# Altium schematic sheet TH8_Supply.schdoc: Thermostat 8CH (part 1 of 2)
size 420 x 297 mm; EDA_Number: ARTIQ; Projet: Thermostat; Author: G.Kasprowicz; CompanyName: WUT ISE; DrawnBy: G.Kasprowicz; Organization: WUT ISE; Address1: PW ISE; Address2: Nowowiejska 15/19 00-665 Warsaw; Address3: gkasprow@gmail.com; DocumentNumber: 5; Revision: 2.0; SheetNumber: 5; SheetTotal: 9; ModifiedBy: -; CheckedDate: -; Title2: Power supply; DivGrp: WUT ISE; Designer: G.Kasprowicz; ModifiedDate: -; ProjectName: Sensor Box
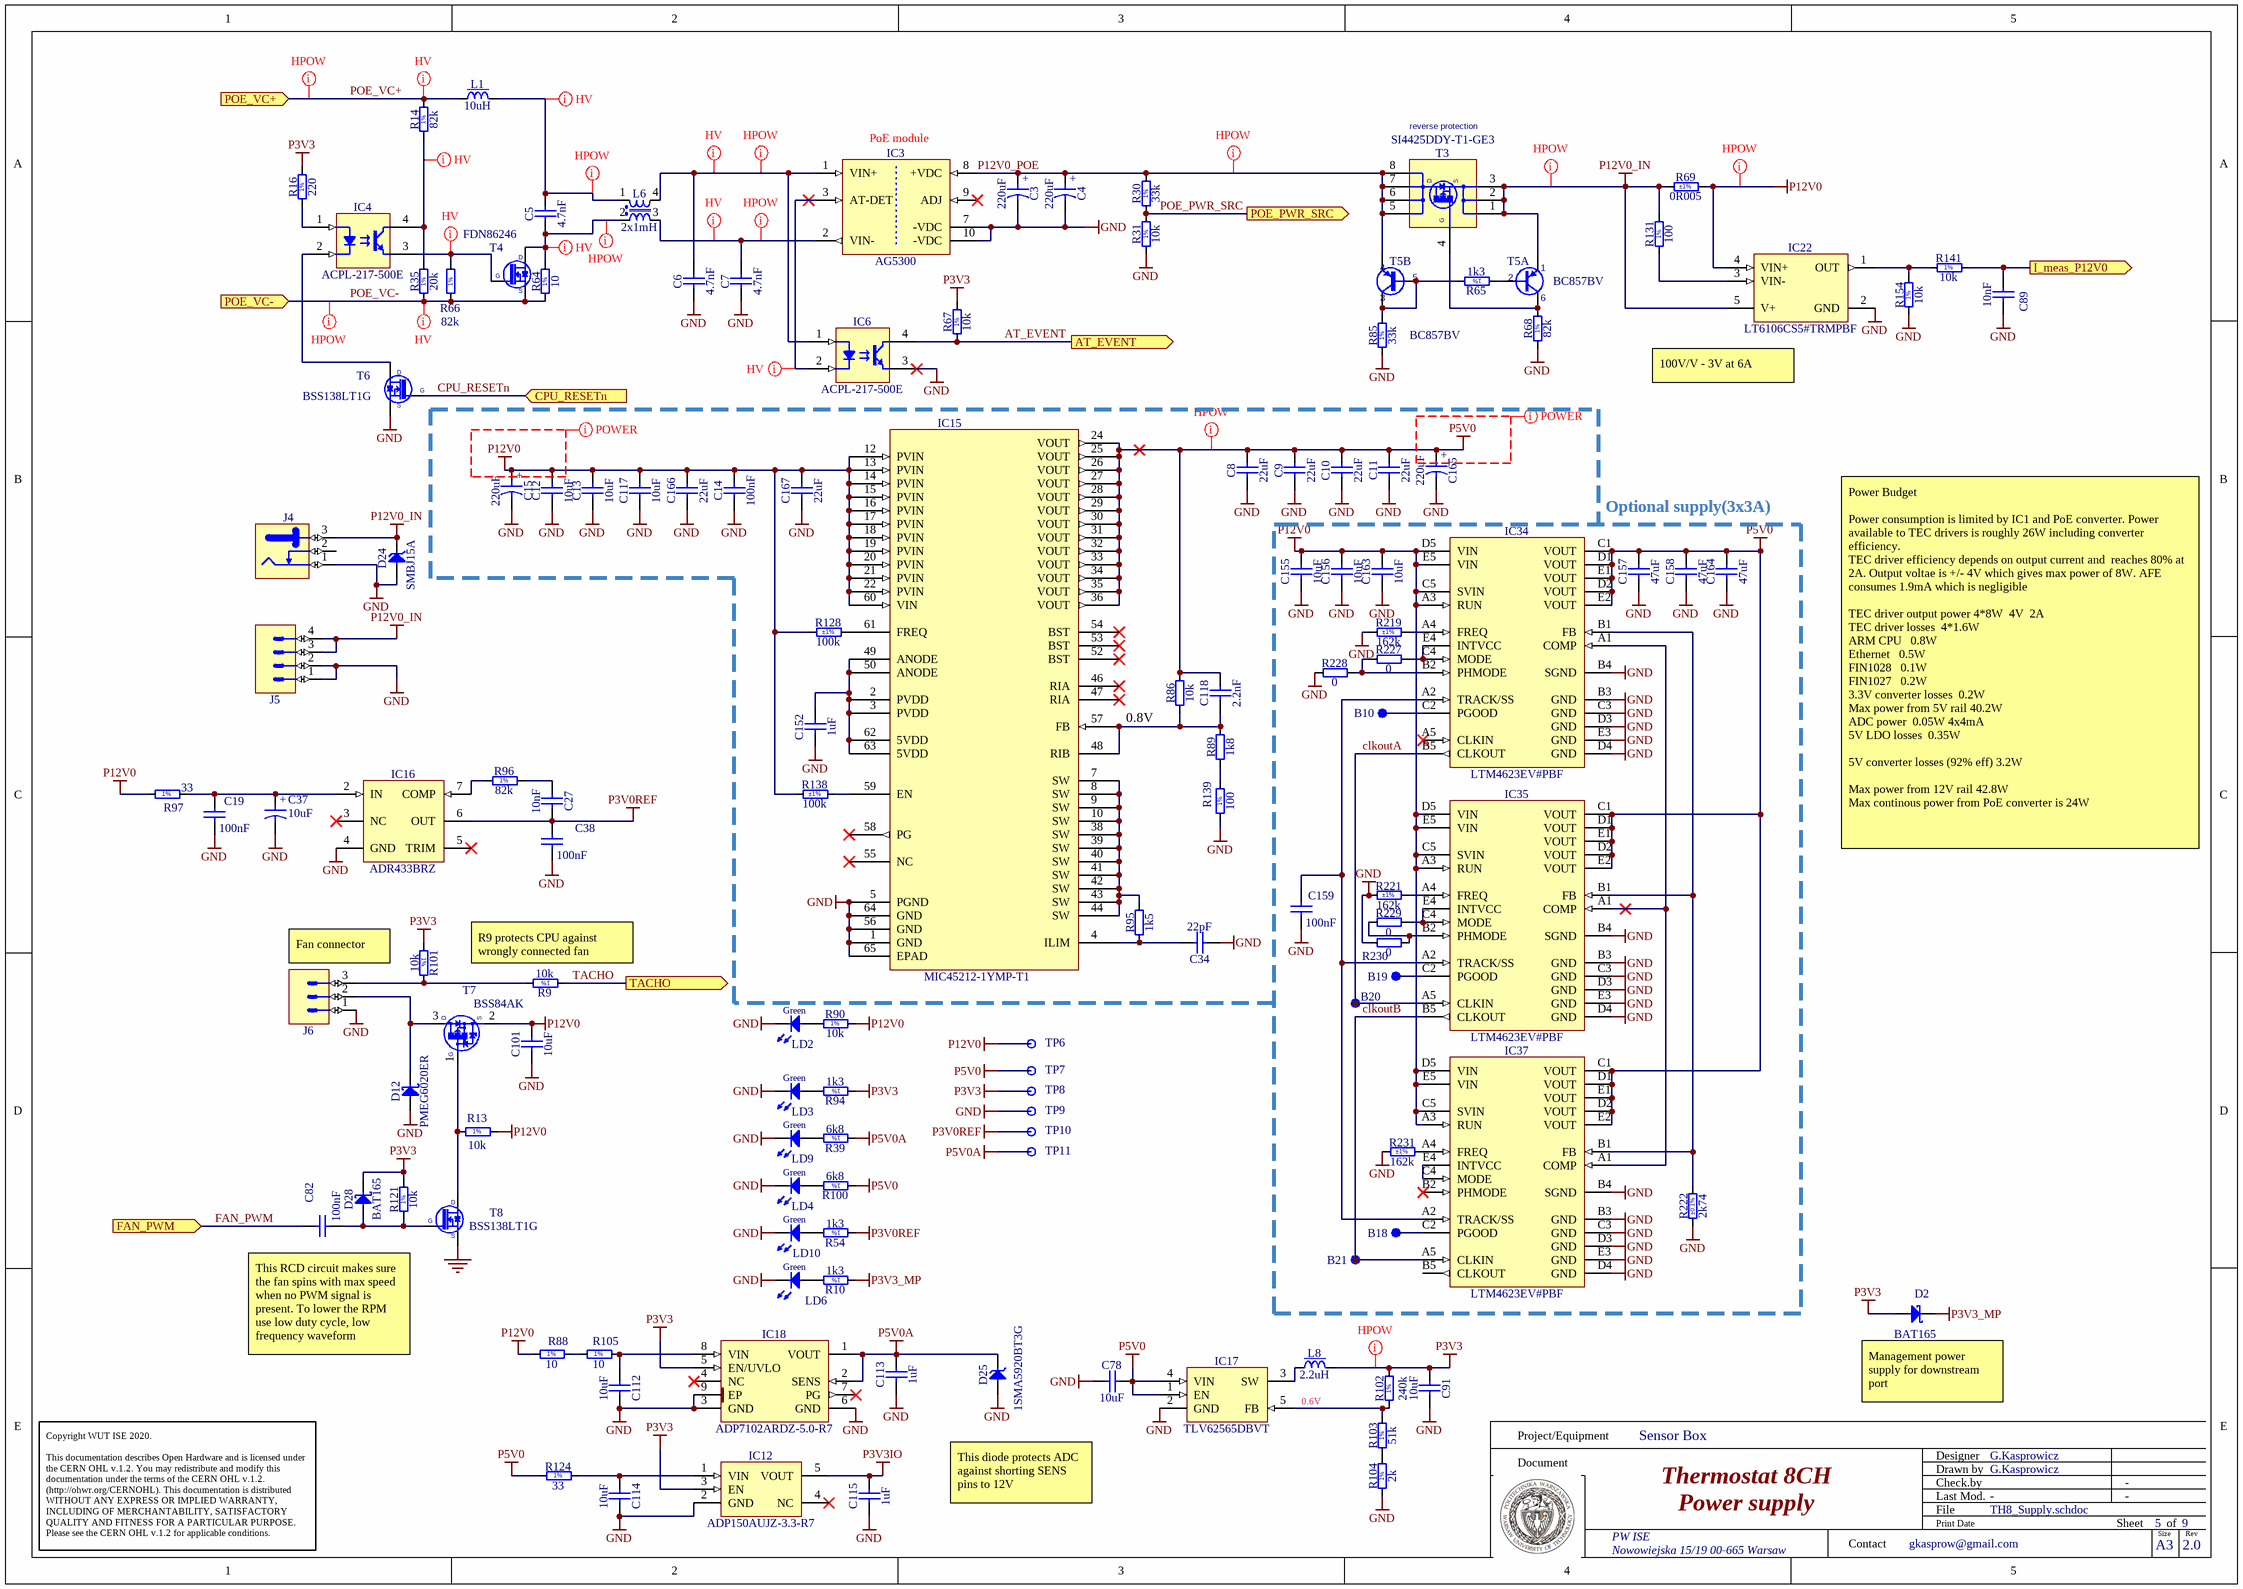
[diagram p0: TH8_Supply.schdoc]

## Parts
B10  SMD Pad  [C75]  (value not drawn)  (no BOM)
B18  SMD Pad  [C75]  (value not drawn)  (no BOM)
B19  SMD Pad  [C75]  (value not drawn)  (no BOM)
B20  SMD Pad  [C75]  (value not drawn)  (no BOM)
B21  SMD Pad  [C75]  (value not drawn)  (no BOM)
C3  220uF  [CAPMP7343X430N]
C4  220uF  [CAPMP7343X430N]
C5  4.7nF  [CAPC3216X140N]
C6  4.7nF  [CAPC3216X140N]
C7  4.7nF  [CAPC3216X140N]
C8  22uF  [CAPC2012X135N]
C9  22uF  [CAPC2012X135N]
C10  22uF  [CAPC2012X135N]
C11  22uF  [CAPC2012X135N]
C12  10uF  [CAPC2012X135N]
C13  10uF  [CAPC2012X135N]
C14  100nF  [CAPC1005X55N]
C15  220uF  [CAPMP7343X430N]
C19  100nF  [CAPC1005X55N]
C27  10nF  [CAPC1005X55N]
C34  22pF  [CAPC1005X55N]
C37  10uF  [CAPMP3216X180N]
C38  100nF  [CAPC1005X55N]
C78  10uF  [CAPC2012X135N]
C82  100nF  [CAPC1005X55N]
C89  10nF  [CAPC1005X55N]
C91  10uF  [CAPC2012X135N]
C101  10uF  [CAPC2012X135N]
C112  10uF  [CAPC2012X135N]
C113  1uF  [CAPC1608X87N]
C114  10uF  [CAPC2012X135N]
C115  1uF  [CAPC1608X87N]
C117  10uF  [CAPC2012X135N]
C118  2.2nF  [CAPC1608X87N]
C152  1uF  [CAPC1608X87N]
C155  10uF  [CAPC2012X135N]
C156  10uF  [CAPC2012X135N]
C157  47uF  [CAPC2012X145N]
C158  47uF  [CAPC2012X145N]
C159  100nF  [CAPC1005X55N]
C163  10uF  [CAPC2012X135N]
C164  47uF  [CAPC2012X145N]
C165  220uF  [CAPMP7343X430N]
C166  22uF  [CAPC2012X135N]
C167  22uF  [CAPC2012X135N]
D2  BAT165  [SOD2512X110N]
D12  PMEG6020ER  [SODFL3517X110N]
D24  SMBJ15A  [DIOM5336X265N]
D25  1SMA5920BT3G  [DIOM5226X220N]
D28  BAT165  [SOD2512X110N]
IC3  AG5300  [SILVERTEL_AG5300]
IC4  ACPL-217-500E  [SOIC127P700X242-4N]
IC6  ACPL-217-500E  [SOIC127P700X242-4N]
IC12  ADP150AUJZ-3.3-R7  [SOT95P280X90-5N]
IC15  MIC45212-1YMP-T1  [MICROCHIP_QFN64_12X12]
IC16  ADR433BRZ  [SOIC127P600X175-8N]
IC17  TLV62565DBVT  [SOT95P280X145-5N]
IC18  ADP7102ARDZ-5.0-R7  [SOIC127P600X175-9N-R241X309]
IC22  LT6106CS5#TRMPBF  [SOT95P280X145-5N]
IC34  LTM4623EV#PBF  [LGA25C127P5X5_625X625X192]
IC35  LTM4623EV#PBF  [LGA25C127P5X5_625X625X192]
IC37  LTM4623EV#PBF  [LGA25C127P5X5_625X625X192]
J4  Jack  [SWITCHCRAFT_L712RA]  (value not drawn)
J5  Mini-Fit Jr.™  [MOLEX_39-30-0040]  (value not drawn)
J6  KK®  [MOLEX_22-27-2031]  (value not drawn)
L1  10uH  [IND_MURATA-PS_8400]
L6  2x1mH  [IND_WURTH_WE-SL2]
L8  2.2uH  [IND_MURATA_LQH44PN_P0]
LD2  Green  [LED_KINGBRIGHT_KPH-1608CGCK]
LD3  Green  [LED_KINGBRIGHT_KPH-1608CGCK]
LD4  Green  [LED_KINGBRIGHT_KPH-1608CGCK]
LD6  Green  [LED_KINGBRIGHT_KPH-1608CGCK]
LD9  Green  [LED_KINGBRIGHT_KPH-1608CGCK]
LD10  Green  [LED_KINGBRIGHT_KPH-1608CGCK]
R9  10k  [RESC1005X40N]
R10  1k3  [RESC1608X55N]
R13  10k  [RESC1005X40N]
R14  82k  [RESC1608X55N]
R16  220  [RESC1608X55N]
R30  33k  [RESC1005X40N]
R31  10k  [RESC1005X40N]
R35  20k  [RESC1005X40N]
R39  6k8  [RESC1005X40N]
R54  1k3  [RESC1608X55N]
R64  10  [RESC2012X60N]
R65  1k3  [RESC1608X55N]
R66  82k  [RESC1608X55N]
R67  10k  [RESC1005X40N]
R68  82k  [RESC1608X55N]
R69  0R005  Tolerance: ±1%  [RESC3216X80N]
R85  33k  [RESC1005X40N]
R86  10k  [RESC1005X40N]
R88  10  [RESC2012X60N]
R89  1k8  [RESC1608X55N]
R90  10k  [RESC1005X40N]
R94  1k3  [RESC1608X55N]
R95  1k5  [RESC1005X40N]
R96  82k  [RESC1608X55N]
R97  33  [RESC1005X40N]
R100  6k8  [RESC1005X40N]
R101  10k  [RESC1005X40N]
R102  240k  [RESC1005X40N]
R103  51k  [RESC1005X40N]
R104  2k  [RESC1005X40N]
R105  10  [RESC2012X60N]
R121  10k  [RESC1005X40N]
R124  33  [RESC1005X40N]
R128  100k  Tolerance: ±1%  [RESC1005X40N]
R131  100  [RESC1005X40N]
R138  100k  Tolerance: ±1%  [RESC1005X40N]
R139  100  [RESC1005X40N]
R141  10k  [RESC1005X40N]
R154  10k  [RESC1005X40N]
R219  162k  Tolerance: ±1%  [RESC1005X40N]
R221  162k  Tolerance: ±1%  [RESC1005X40N]
R222  2k74  Tolerance: ±0.1%  [RESC1608X55N]
R227  0  [RESC1005X40N]
R228  0  [RESC1005X40N]
R229  0  [RESC1005X40N]
R230  0  [RESC1005X40N]
R231  162k  Tolerance: ±1%  [RESC1005X40N]
T3  SI4425DDY-T1-GE3  [SOIC127P600X175-8N]
T4  FDN86246  [SOT95P237X112-3N]
T5  BC857BV  [SOTFL50P160X60-6N]  (parts A,B of 2)
T6  BSS138LT1G  [SOT95P240X110-3N]
T7  BSS84AK  [SOT95P230X110-3N]
T8  BSS138LT1G  [SOT95P240X110-3N]
TP6  Test Point  [TPS127]  (value not drawn)
TP7  Test Point  [TPS127]  (value not drawn)
TP8  Test Point  [TPS127]  (value not drawn)
TP9  Test Point  [TPS127]  (value not drawn)
TP10  Test Point  [TPS127]  (value not drawn)
TP11  Test Point  [TPS127]  (value not drawn)

## Blocks framed on the sheet
Optional supply(3x3A): B10 B18-B21 C155-C159 C163 C164 IC34 IC35 IC37 R219 R221 R222 R227-R231

## Ports
AT_EVENT (out), CPU_RESETn (in), FAN_PWM (in), I_meas_P12V0 (out), POE_PWR_SRC (out), POE_VC+ (in), POE_VC- (in), TACHO (out)

## Nets
GND: C3.2 C4.2 C6.1 C7.1 C8.1 C9.1 C10.1 C11.1 C12.1 C13.1 C14.1 C15.2 C19.2 C34.1 C37.2 C38.2 C78.1 C89.2 C91.2 C101.1 C112.2 C113.1 C114.2 C115.1 C117.1 C152.1 C155.1 C156.1 C157.1 C158.1 C159.2 C163.1 C164.1 C165.2 C166.1 C167.1 D12.2(A) D24.2(A) D25.2(A) IC3.7(-VDC) IC3.10(-VDC) IC6.3(E) IC12.2(GND) IC15.1(GND) IC15.5(PGND) IC15.56(GND) IC15.64(GND) IC15.65(EPAD) IC16.4(GND) IC17.2(GND) IC18.3(GND) IC18.6(GND) IC18.9(EP) IC22.2(GND) IC34.B3(GND) IC34.B4(SGND) IC34.C3(GND) IC34.D3(GND) IC34.D4(GND) IC34.E3(GND) IC35.B3(GND) IC35.B4(SGND) IC35.C3(GND) IC35.D3(GND) IC35.D4(GND) IC35.E3(GND) IC37.B3(GND) IC37.B4(SGND) IC37.C3(GND) IC37.D3(GND) IC37.D4(GND) IC37.E3(GND) J4.1 J5.1 J5.2 J6.1 LD2.1(C) LD3.1(C) LD4.1(C) LD6.1(C) LD9.1(C) LD10.1(C) R31.1 R68.1 R85.1 R104.1 R139.1 R154.1 R219.1 R221.1 R222.1 R228.1 R230.1 R231.1 T6.2(S) T8.2(S) TP9.1
P3V0REF: C27.2 C38.1 IC16.6(OUT) R54.1 TP10.1
P3V3: C91.1 D2.2(A) D28.1(C) IC12.3(EN) IC18.5(EN/UVLO) L8.2 R16.2 R67.2 R94.1 R101.1 R102.2 R121.2 TP8.1
P3V3_MP: D2.1(C) R10.1
P3V3IO: C115.2 IC12.5(VOUT)
P5V0: C8.2 C9.2 C10.2 C11.2 C78.2 C118.2 C157.2 C158.2 C164.2 C165.1 IC15.24(VOUT) IC15.25(VOUT) IC15.26(VOUT) IC15.27(VOUT) IC15.28(VOUT) IC15.29(VOUT) IC15.30(VOUT) IC15.31(VOUT) IC15.32(VOUT) IC15.33(VOUT) IC15.34(VOUT) IC15.35(VOUT) IC15.36(VOUT) IC17.1(EN) IC17.4(VIN) IC34.C1(VOUT) IC34.D1(VOUT) IC34.D2(VOUT) IC34.E1(VOUT) IC34.E2(VOUT) IC35.C1(VOUT) IC35.D1(VOUT) IC35.D2(VOUT) IC35.E1(VOUT) IC35.E2(VOUT) IC37.C1(VOUT) IC37.D1(VOUT) IC37.D2(VOUT) IC37.E1(VOUT) IC37.E2(VOUT) R86.2 R100.1 R124.1 TP7.1
P5V0A: C113.2 D25.1(C) IC18.1(VOUT) IC18.2(SENS) R39.1 TP11.1
P12V0: C12.2 C13.2 C14.2 C15.1 C101.2 C117.2 C155.2 C156.2 C163.2 C166.2 C167.2 IC15.12(PVIN) IC15.13(PVIN) IC15.14(PVIN) IC15.15(PVIN) IC15.16(PVIN) IC15.17(PVIN) IC15.18(PVIN) IC15.19(PVIN) IC15.20(PVIN) IC15.21(PVIN) IC15.22(PVIN) IC15.60(VIN) IC22.4(VIN+) IC34.A3(RUN) IC34.C5(SVIN) IC34.D5(VIN) IC34.E5(VIN) IC35.A3(RUN) IC35.C5(SVIN) IC35.D5(VIN) IC35.E5(VIN) IC37.A3(RUN) IC37.C5(SVIN) IC37.D5(VIN) IC37.E5(VIN) R13.2 R69.2 R88.1 R90.2 R97.1 R128.1 R138.1 T7.2(S) TP6.1
P12V0_IN: D24.1(C) IC22.5(V+) J4.3 J5.3 J5.4 R69.1 R131.2 T3.1(S) T3.2(S) T3.3(S) T5.1(E)
AT_EVENT: IC6.4(C) R67.1 ; port AT_EVENT
clkoutA: B20.1 IC34.B5(CLKOUT) IC35.A5(CLKIN)
clkoutB: B21.1 IC35.B5(CLKOUT) IC37.A5(CLKIN)
CPU_RESETn: T6.1(G) ; port CPU_RESETn
FAN_PWM: C82.1 ; port FAN_PWM
I_meas_P12V0: C89.1 R141.2 ; port I_meas_P12V0
P12V0_POE: C3.1 C4.1 IC3.8(+VDC) R30.2 T3.5(D) T3.6(D) T3.7(D) T3.8(D) T5.4(E)
POE_PWR_SRC: R30.1 R31.2 ; port POE_PWR_SRC
POE_VC+: L1.1 R14.2 ; port POE_VC+
POE_VC-: R35.1 R64.1 R66.1 T4.2(S) ; port POE_VC-
TACHO: R9.1 ; port TACHO
NetB10_1: B10.1 IC34.C2(PGOOD)
NetB18_1: B18.1 IC37.C2(PGOOD)
NetB19_1: B19.1 IC35.C2(PGOOD)
NetC5_1: C5.1 L6.2 R64.2 T4.3(D)
NetC5_2: C5.2 L1.2 L6.1
NetC6_2: C6.2 IC3.1(VIN+) IC6.1(A) L6.4
NetC7_2: C7.2 IC3.2(VIN-) L6.3
NetC19_1: C19.1 C37.1 IC16.2(IN) R97.2
NetC27_1: C27.1 R96.2
NetC34_2: C34.2 IC15.4(ILIM) R95.1
NetC82_2: C82.2 D28.2(A) R121.1 T8.1(G)
NetC112_1: C112.1 IC18.8(VIN) R105.2
NetC114_1: C114.1 IC12.1(VIN) R124.2
NetC118_1: C118.1 IC15.48(RIB) IC15.57(FB) R86.1 R89.2
NetC152_2: C152.2 IC15.2(PVDD) IC15.3(PVDD) IC15.49(ANODE) IC15.50(ANODE) IC15.62(5VDD) IC15.63(5VDD)
NetC159_1: C159.1 IC34.A2(TRACK/SS) IC35.A2(TRACK/SS) IC37.A2(TRACK/SS)
NetD12_1: D12.1(C) J6.2 T7.3(D)
NetIC3_3: IC3.3(AT-DET) IC6.2(C)
NetIC4_1: IC4.1(A) R16.1
NetIC4_2: IC4.2(C) T6.3(D)
NetIC4_3: IC4.3(E) R66.2 T4.1(G)
NetIC4_4: IC4.4(C) R14.1 R35.2
NetIC15_7: IC15.7(SW) IC15.8(SW) IC15.9(SW) IC15.10(SW) IC15.38(SW) IC15.39(SW) IC15.40(SW) IC15.41(SW) IC15.42(SW) IC15.43(SW) IC15.44(SW) R95.2
NetIC15_59: IC15.59(EN) R138.2
NetIC15_61: IC15.61(FREQ) R128.2
NetIC16_7: IC16.7(COMP) R96.1
NetIC17_3: IC17.3(SW) L8.1
NetIC17_5: IC17.5(FB) R102.1 R103.2
NetIC22_1: IC22.1(OUT) R141.1 R154.2
NetIC22_3: IC22.3(VIN-) R131.1
NetIC34_A1: IC34.A1(COMP) IC35.A1(COMP) IC37.A1(COMP)
NetIC34_A4: IC34.A4(FREQ) R219.2
NetIC34_B1: IC34.B1(FB) IC35.B1(FB) IC37.B1(FB) R222.2
NetIC34_B2: IC34.B2(PHMODE) R227.1 R228.2
NetIC34_C4: IC34.C4(MODE) IC34.E4(INTVCC) R227.2
NetIC35_A4: IC35.A4(FREQ) R221.2
NetIC35_B2: IC35.B2(PHMODE) R229.1 R230.2
NetIC35_C4: IC35.C4(MODE) IC35.E4(INTVCC) R229.2
NetIC37_A4: IC37.A4(FREQ) R231.2
NetIC37_C4: IC37.C4(MODE) IC37.E4(INTVCC)
NetJ6_3: J6.3 R9.2 R101.2
NetLD2_2: LD2.2(A) R90.1
NetLD3_2: LD3.2(A) R94.2
NetLD4_2: LD4.2(A) R100.2
NetLD6_2: LD6.2(A) R10.2
NetLD9_2: LD9.2(A) R39.2
NetLD10_2: LD10.2(A) R54.2
NetR13_1: R13.1 T7.1(G) T8.3(D)
NetR65_1: R65.1 T5.2(B)
NetR65_2: R65.2 R85.2 T5.3(C) T5.5(B)
NetR68_2: R68.2 T3.4(S) T5.6(C)
NetR88_2: R88.2 R105.1
NetR89_1: R89.1 R139.2
NetR103_1: R103.1 R104.2

Not connected (* = marked no-connect by the designer): IC3 9(ADJ)*; IC12 4(NC)*; IC15 46(RIA)* 47(RIA)* 52(BST)* 53(BST)* 54(BST)* 55(NC)* 58(PG)*; IC16 3(NC)* 5(TRIM)*; IC18 4(NC)* 7(PG)*; IC34 A5(CLKIN)*; IC37 B2(PHMODE)* B5(CLKOUT); J4 2

## Layout directives
net class POWER: P5V0, P12V0
net class HV: NetC5_1, NetC5_2, NetC6_2, NetC7_2, NetIC3_3, NetIC4_3, NetIC4_4, POE_VC+, POE_VC-
net class HPOW: NetC5_1, NetC5_2, NetC6_2, NetC7_2, P3V3, P5V0, P12V0, P12V0_IN, P12V0_POE, POE_VC+, POE_VC-

## Notes on the sheet
- (near T3) reverse protection
- (near IC3) PoE module
- (near IC22) 100V/V - 3V at 6A
- (near R86) 0.8V
- Power Budget
  Power consumption is limited by IC1 and PoE converter. Power available to TEC drivers is roughly 26W including converter efficiency.
  TEC driver efficiency depends on output current and  reaches 80% at 2A. Output voltae is +/- 4V which gives max power of 8W. AFE consumes 1.9mA which is negligible
  TEC driver output power	4*8W 	4V 	2A
  TEC driver losses		4*1.6W
  ARM CPU			0.8W
  Ethernet			0.5W
  FIN1028			0.1W
  FIN1027			0.2W
  3.3V converter losses		0.2W
  Max power from 5V rail	40.2W
  ADC power		0.05W	4x4mA
  5V LDO losses		0.35W
  5V converter losses	(92% eff)	3.2W
  Max power from 12V rail	42.8W
  Max continous power from PoE converter is 24W
- Fan connector
- (near R9) R9 protects CPU against wrongly connected fan
- This RCD circuit makes sure the fan spins with max speed when no PWM signal is present. To lower the RPM use low duty cycle, low frequency waveform
- 0.6V
- (near D2) Management power supply for downstream port
- This diode protects ADC against shorting SENS pins to 12V
- Project/Equipment
- Document
- Designer
- Drawn by
- Check.by
- Copyright WUT ISE 2020.
  This documentation describes Open Hardware and is licensed under the CERN OHL v.1.2. You may redistribute and modify this documentation under the terms of the CERN OHL v.1.2. (http://ohwr.org/CERNOHL). This documentation is distributed WITHOUT ANY EXPRESS OR IMPLIED WARRANTY, INCLUDING OF MERCHANTABILITY, SATISFACTORY QUALITY AND FITNESS FOR A PARTICULAR PURPOSE. Please see the CERN OHL v.1.2 for applicable conditions.
- Contact
- File
- Last Mod.
- Print Date
- Sheet
- Size
- A3
- of
- Rev
- (in symbol CTE3216-18_10UF_16V_20%_AVX_TCJ) +
- (in symbol CTE7343-43_220UF_16V_10%) +
- (in symbol R0402_2K_1%_0.0625W_100PPM) 1%
- (in symbol R0402_6K8_1%_0.0625W_100PPM) 1%
- (in symbol R0402_10K_1%_0.0625W_100PPM) 1%
- (in symbol R0402_10k_1%_0.0625W_100PPM) 1%
- (in symbol R0402_20K_1%_0.0625W_100PPM) 1%
- (in symbol R0402_33K_1%_0.0625W_100PPM) 1%
- (in symbol R0402_33R_1%_0.0625W_100PPM) 1%
- (in symbol R0402_51K_1%_0.0625W_100PPM) 1%
- (in symbol R0402_100R_1%_0.0625W_100PPM) 1%
- (in symbol R0402_240K_1%_0.0625W_100PPM) 1%
- (in symbol R0603_1K3_1%_0.1W_100PPM) 1%
- (in symbol R0603_82K_1%_0.1W_100PPM) 1%
- (in symbol R0603_220R_1%_0.1W_100PPM) 1%
- (in symbol R0805_10R_1%_0.125W_200PPM) 1%
- (in symbol SI4425DDY-T1-GE3) G